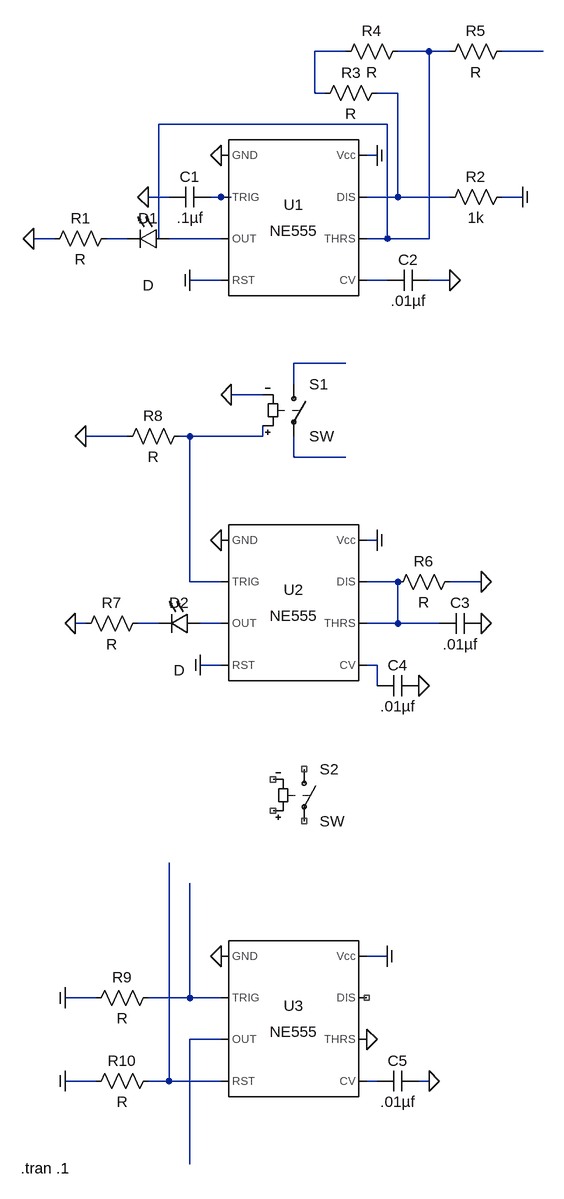
[diagram p0: schematic clock.asc]
clock.asc, the LTspice schematic file:
Version 4
SHEET 1 880 1656
WIRE 288 -80 240 -80
WIRE 416 -80 368 -80
WIRE 448 -80 416 -80
WIRE 592 -80 528 -80
WIRE 240 -16 240 -80
WIRE 256 -16 240 -16
WIRE 368 -16 336 -16
WIRE 352 32 0 32
WIRE 336 80 320 80
WIRE 16 144 -16 144
WIRE 96 144 80 144
WIRE 112 144 96 144
WIRE 368 144 368 -16
WIRE 368 144 320 144
WIRE 448 144 368 144
WIRE 560 144 528 144
WIRE -160 208 -192 208
WIRE -48 208 -80 208
WIRE 0 208 0 32
WIRE 96 208 16 208
WIRE 352 208 352 32
WIRE 352 208 320 208
WIRE 416 208 416 -80
WIRE 416 208 352 208
WIRE 96 272 48 272
WIRE 352 272 320 272
WIRE 448 272 416 272
WIRE 288 400 208 400
WIRE 208 432 208 400
WIRE 160 448 112 448
WIRE -48 512 -112 512
WIRE 48 512 32 512
WIRE 160 512 160 496
WIRE 160 512 48 512
WIRE 208 544 208 512
WIRE 288 544 208 544
WIRE 336 672 320 672
WIRE 48 736 48 512
WIRE 96 736 48 736
WIRE 368 736 320 736
WIRE 496 736 448 736
WIRE -112 800 -128 800
WIRE 0 800 -32 800
WIRE 96 800 64 800
WIRE 368 800 368 736
WIRE 368 800 320 800
WIRE 432 800 368 800
WIRE 96 864 64 864
WIRE 336 864 320 864
WIRE 336 896 336 864
WIRE 352 1312 320 1312
WIRE -96 1376 -144 1376
WIRE 48 1376 48 1200
WIRE 48 1376 -16 1376
WIRE 96 1376 48 1376
WIRE 96 1440 48 1440
WIRE -96 1504 -144 1504
WIRE 16 1504 16 1168
WIRE 16 1504 -16 1504
WIRE 96 1504 16 1504
WIRE 336 1504 320 1504
WIRE 416 1504 400 1504
WIRE 48 1632 48 1440
FLAG 48 272 COM
FLAG -192 208 0
FLAG 448 272 0
FLAG 336 80 COM
FLAG 560 144 COM
FLAG 96 672 0
FLAG 496 800 0
FLAG 400 896 0
FLAG 336 672 COM
FLAG 496 736 0
FLAG 64 864 COM
FLAG -128 800 0
FLAG 112 448 0
FLAG -112 512 0
FLAG 96 1312 0
FLAG 352 1312 COM
FLAG 320 1440 0
FLAG 416 1504 0
FLAG -144 1376 COM
FLAG -144 1504 COM
FLAG 96 80 0
FLAG -16 144 0
SYMBOL Misc\\NE555 208 176 R0
SYMATTR InstName U1
SYMBOL LED 16 192 R90
WINDOW 0 0 32 VBottom 2
WINDOW 3 72 32 VTop 2
SYMATTR InstName D1
SYMBOL res -64 192 R90
WINDOW 0 0 56 VBottom 2
WINDOW 3 32 56 VTop 2
SYMATTR InstName R1
SYMBOL cap 416 256 R90
WINDOW 0 0 32 VBottom 2
WINDOW 3 32 32 VTop 2
SYMATTR InstName C2
SYMATTR Value .01µf
SYMBOL res 544 128 R90
WINDOW 0 0 56 VBottom 2
WINDOW 3 32 56 VTop 2
SYMATTR InstName R2
SYMATTR Value 1k
SYMBOL res 384 -96 R90
WINDOW 0 0 56 VBottom 2
WINDOW 3 32 56 VTop 2
SYMATTR InstName R4
SYMBOL res 544 -96 R90
WINDOW 0 0 56 VBottom 2
WINDOW 3 32 56 VTop 2
SYMATTR InstName R5
SYMBOL Misc\\NE555 208 768 R0
SYMATTR InstName U2
SYMBOL cap 496 784 R90
WINDOW 0 0 32 VBottom 2
WINDOW 3 32 32 VTop 2
SYMATTR InstName C3
SYMATTR Value .01µf
SYMBOL cap 400 880 R90
WINDOW 0 0 32 VBottom 2
WINDOW 3 32 32 VTop 2
SYMATTR InstName C4
SYMATTR Value .01µf
SYMBOL res 464 720 R90
WINDOW 0 0 56 VBottom 2
WINDOW 3 32 56 VTop 2
SYMATTR InstName R6
SYMBOL LED 64 784 R90
WINDOW 0 0 32 VBottom 2
WINDOW 3 72 32 VTop 2
SYMATTR InstName D2
SYMBOL res -16 784 R90
WINDOW 0 0 56 VBottom 2
WINDOW 3 32 56 VTop 2
SYMATTR InstName R7
SYMBOL sw 208 416 R0
SYMATTR InstName S1
SYMBOL res 48 496 R90
WINDOW 0 0 56 VBottom 2
WINDOW 3 32 56 VTop 2
SYMATTR InstName R8
SYMBOL sw 224 1008 R0
SYMATTR InstName S2
SYMBOL Misc\\NE555 208 1408 R0
SYMATTR InstName U3
SYMBOL cap 400 1488 R90
WINDOW 0 0 32 VBottom 2
WINDOW 3 32 32 VTop 2
SYMATTR InstName C5
SYMATTR Value .01µf
SYMBOL res 0 1360 R90
WINDOW 0 0 56 VBottom 2
WINDOW 3 32 56 VTop 2
SYMATTR InstName R9
SYMBOL res 0 1488 R90
WINDOW 0 0 56 VBottom 2
WINDOW 3 32 56 VTop 2
SYMATTR InstName R10
SYMBOL cap 80 128 R90
WINDOW 0 0 32 VBottom 2
WINDOW 3 32 32 VTop 2
SYMATTR InstName C1
SYMATTR Value .1µf
SYMBOL res 352 -32 R90
WINDOW 0 0 56 VBottom 2
WINDOW 3 32 56 VTop 2
SYMATTR InstName R3
TEXT -212 1638 Left 2 !.tran .1

The netlist it stands for:
* clock.asc
XU1 0 N005 N007 COM N008 N002 N004 COM NE555  ; pins GND TRIG OUT RST CV THRS DIS Vcc
D1 N007 N006 D
R1 N006 0 R
C2 0 N008 .01µf
R2 COM N004 1k
R4 N002 N001 R
R5 N003 N002 R
XU2 0 N010 N014 COM N015 N012 N012 COM NE555  ; pins GND TRIG OUT RST CV THRS DIS Vcc
C3 0 N012 .01µf
C4 0 N015 .01µf
R6 0 N012 R
D2 N014 N013 D
R7 N013 0 R
S1 N009 N011 N010 0 SW
R8 N010 0 R
S2 NC_01 NC_02 NC_03 NC_04 SW
XU3 0 N016 N017 N018 N019 0 NC_05 COM NE555  ; pins GND TRIG OUT RST CV THRS DIS Vcc
C5 0 N019 .01µf
R9 N016 COM R
R10 N018 COM R
C1 N005 0 .1µf
R3 N004 N001 R
.model D D
.lib standard.dio
.tran .1
.lib NE555.sub
.backanno
.end